# EAGLE schematic Temp-sensor-RS485 (EAGLE 9.5.2)
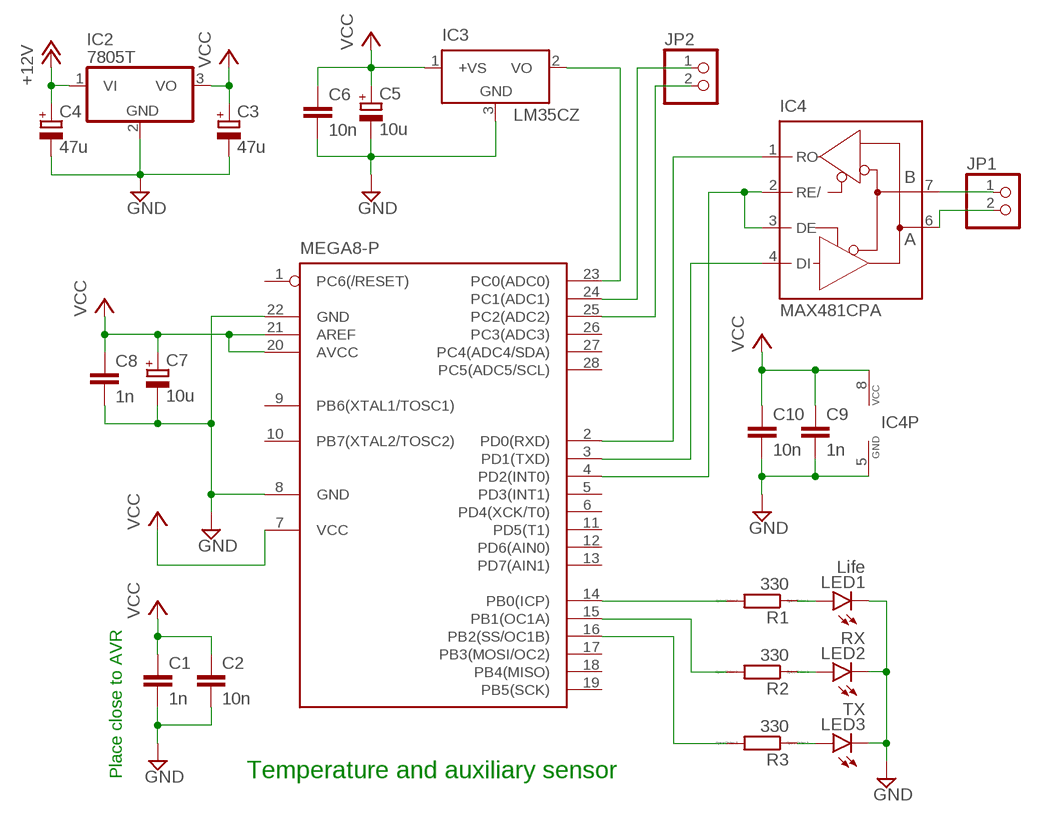
[diagram p0: schematic, sheet 1]

## Parts
C1  1n  C-EU025-024X044  [C025-024X044]
C2  10n  C-EU025-024X044  [C025-024X044]
C3  47u  CPOL-EUE1.8-4  [E1,8-4]
C4  47u  CPOL-EUE1.8-4  [E1,8-4]
C5  10u  CPOL-EUE1.8-4  [E1,8-4]
C6  10n  C-EU025-024X044  [C025-024X044]
C7  10u  CPOL-EUE1.8-4  [E1,8-4]
C8  1n  C-EU025-024X044  [C025-024X044]
C9  1n  C-EU025-024X044  [C025-024X044]
C10  10n  C-EU025-024X044  [C025-024X044]
IC1  MEGA8-P  [DIL28-3]
IC2  7805T  [TO220H]
IC3  LM35CZ  [TO92]
IC4  MAX481CPA  [DIL08]
JP1  PINHD-1X2  [1X02]
JP2  PINHD-1X2  [1X02]
LED1  Life  LED5MM  [LED5MM]
LED2  RX  LED5MM  [LED5MM]
LED3  TX  LED5MM  [LED5MM]
R1  330  R0204/7  [0204/7]
R2  330  R0204/7  [0204/7]
R3  330  R0204/7  [0204/7]

## Nets
+12V: C4.+ IC2.1(VI)
GND: C1.2 C2.2 C3.- C4.- C5.- C6.2 C7.- C8.2 C9.2 C10.2 IC1.8(GND) IC1.22(GND) IC2.2(GND) IC3.3(GND) IC4.5(GND) LED1.K(C) LED2.K(C) LED3.K(C)
N$1: IC4.7(B) JP1.1
N$2: LED1.A R1.1
N$3: IC1.23(PC0(ADC0)) IC3.2(VO)
N$4: LED2.A R2.1
N$5: LED3.A R3.1
N$6: IC1.14(PB0(ICP)) R1.2
N$7: IC1.15(PB1(OC1A)) R2.2
N$8: IC1.16(PB2(SS/OC1B)) R3.2
N$9: IC1.2(PD0(RXD)) IC4.1(RO)
N$10: IC1.3(PD1(TXD)) IC4.4(DI)
N$11: IC1.4(PD2(INT0)) IC4.2(RE/) IC4.3(DE)
N$12: IC4.6(A) JP1.2
N$13: IC1.24(PC1(ADC1)) JP2.1
N$14: IC1.25(PC2(ADC2)) JP2.2
VCC: C1.1 C2.1 C3.+ C5.+ C6.1 C7.+ C8.1 C9.1 C10.1 IC1.7(VCC) IC1.20(AVCC) IC1.21(AREF) IC2.3(VO) IC3.1(+VS) IC4.8(VCC)
Unconnected: IC1.1(PC6(/RESET)) IC1.5(PD3(INT1)) IC1.6(PD4(XCK/T0)) IC1.9(PB6(XTAL1/TOSC1)) IC1.10(PB7(XTAL2/TOSC2)) IC1.11(PD5(T1)) IC1.12(PD6(AIN0)) IC1.13(PD7(AIN1)) IC1.17(PB3(MOSI/OC2)) IC1.18(PB4(MISO)) IC1.19(PB5(SCK)) IC1.26(PC3(ADC3)) IC1.27(PC4(ADC4/SDA)) IC1.28(PC5(ADC5/SCL))

## Notes on the sheet
- Place close to AVR | Temperature and auxiliary sensor

## Library data of the parts
C1 C2 C6 C8-C10 = rcl:C-EU: CAPACITOR, European symbol
C3-C5 C7 = rcl:CPOL-EU: POLARIZED CAPACITOR, European symbol
IC1 = atmel:MEGA8-P: MICROCONTROLLER 8 Kbytes FLASH, 1 kbytes SRAM, 512 bytes EEPROM, USART, 4-channel 10 bit ADC, 2-channel 8 bit ADC Pin compatible with Atmega48, ATMega88, ATMega168 Source: avr.lbr; OC_FARNELL: unknown; OC_NEWARK: unknown
IC2 = linear:78*: Positive VOLTAGE REGULATOR Source: http://cache.national.com/ds/LM/LM78L05.pdf http://www.fairchildsemi.com/ds/LM/LM7805.pdf
IC3 = lm35:LM35: Single-Supply Centigrade Temperature Sensor Vout = (10mV/°C x Temp °C) +5mmmV Source: http://www.national.com/ds/LM/LM35.pdf
IC4 = maxim:MAX481CPA: RS485 TRANSEIVER; MPN: MAX481CPA+; OC_FARNELL: unknown; OC_NEWARK: 99K3445
JP1 JP2 = pinhead:PINHD-1X2: PIN HEADER
LED1-LED3 = led:LED: LED OSRAM: - CHIPLED LG R971, LG N971, LY N971, LG Q971, LY Q971, LO R971, LY R971 LH N974, LH R974 LS Q976, LO Q976, LY Q976 LO Q996 - Hyper CHIPLED LW Q18S LB Q993, LB Q99A, LB R99A - SideLED LS A670, LO A670, LY A670, LG A670, LP A670 LB A673, LV A673, LT A673, LW A673 LH A674 LY A675 LS A676, LA A676, LO A676, LY A676, LW A676 LS A679, LY A679, LG A679 - Hyper Micro SIDELED® LS Y876, LA Y876, LO Y876, LY Y876 LT Y87S - SmartLED LW L88C, LW L88S LB L89C, LB L89S, LG L890 LS L89K, LO L89K, LY L89K LS L896, LA L896, LO L896, LY L896 - TOPLED LS T670, LO T670, LY T670, LG T670, LP T670 LSG T670, LSP T670, LSY T670, LOP T670, LYG T670 LG T671, LOG T671, LSG T671 LB T673, LV T673, LT T673, LW T673 LH T674 LS T676, LA T676, LO T676, LY T676, LB T676, LH T676, LSB T676, LW T676 LB T67C, LV T67C, LT T67C, LS T67K, LO T67K, LY T67K, LW E67C LS E67B, LA E67B, LO E67B, LY E67B, LB E67C, LV E67C, LT E67C LW T67C LS T679, LY T679, LG T679 LS T770, LO T770, LY T770, LG T770, LP T770 LB T773, LV T773, LT T773, LW T773 LH T774 LS E675, LA E675, LY E675, LS T675 LS T776, LA T776, LO T776, LY T776, LB T776 LHGB T686 LT T68C, LB T68C - Hyper Mini TOPLED® LB M676 - Mini TOPLED Santana® LG M470 LS M47K, LO M47K, LY M47K Source: http://www.osram.convergy.de LUXEON: - LUMILED® LXK2-PW12-R00, LXK2-PW12-S00, LXK2-PW14-U00, LXK2-PW14-V00 LXK2-PM12-R00, LXK2-PM12-S00, LXK2-PM14-U00 LXK2-PE12-Q00, LXK2-PE12-R00, LXK2-PE12-S00, LXK2-PE14-T00, LXK2-PE14-U00 LXK2-PB12-K00, LXK2-PB12-L00, LXK2-PB12-M00, LXK2-PB14-N00, LXK2-PB14-P00, LXK2-PB14-Q00 LXK2-PR12-L00, LXK2-PR12-M00, LXK2-PR14-Q00, LXK2-PR14-R00 LXK2-PD12-Q00, LXK2-PD12-R00, LXK2-PD12-S00 LXK2-PH12-R00, LXK2-PH12-S00 LXK2-PL12-P00, LXK2-PL12-Q00, LXK2-PL12-R00 Source: www.luxeon.com KINGBRIGHT: KA-3528ASYC Source: www.kingbright.com
R1-R3 = eagle-ltspice:R: RESISTOR, European symbol; SPICEMODEL: NONE; SPICEPREFIX: R